# Altium schematic sheet STM32F407VG_B.SchDoc
size A4; SheetNumber: 4; SheetTotal: 8
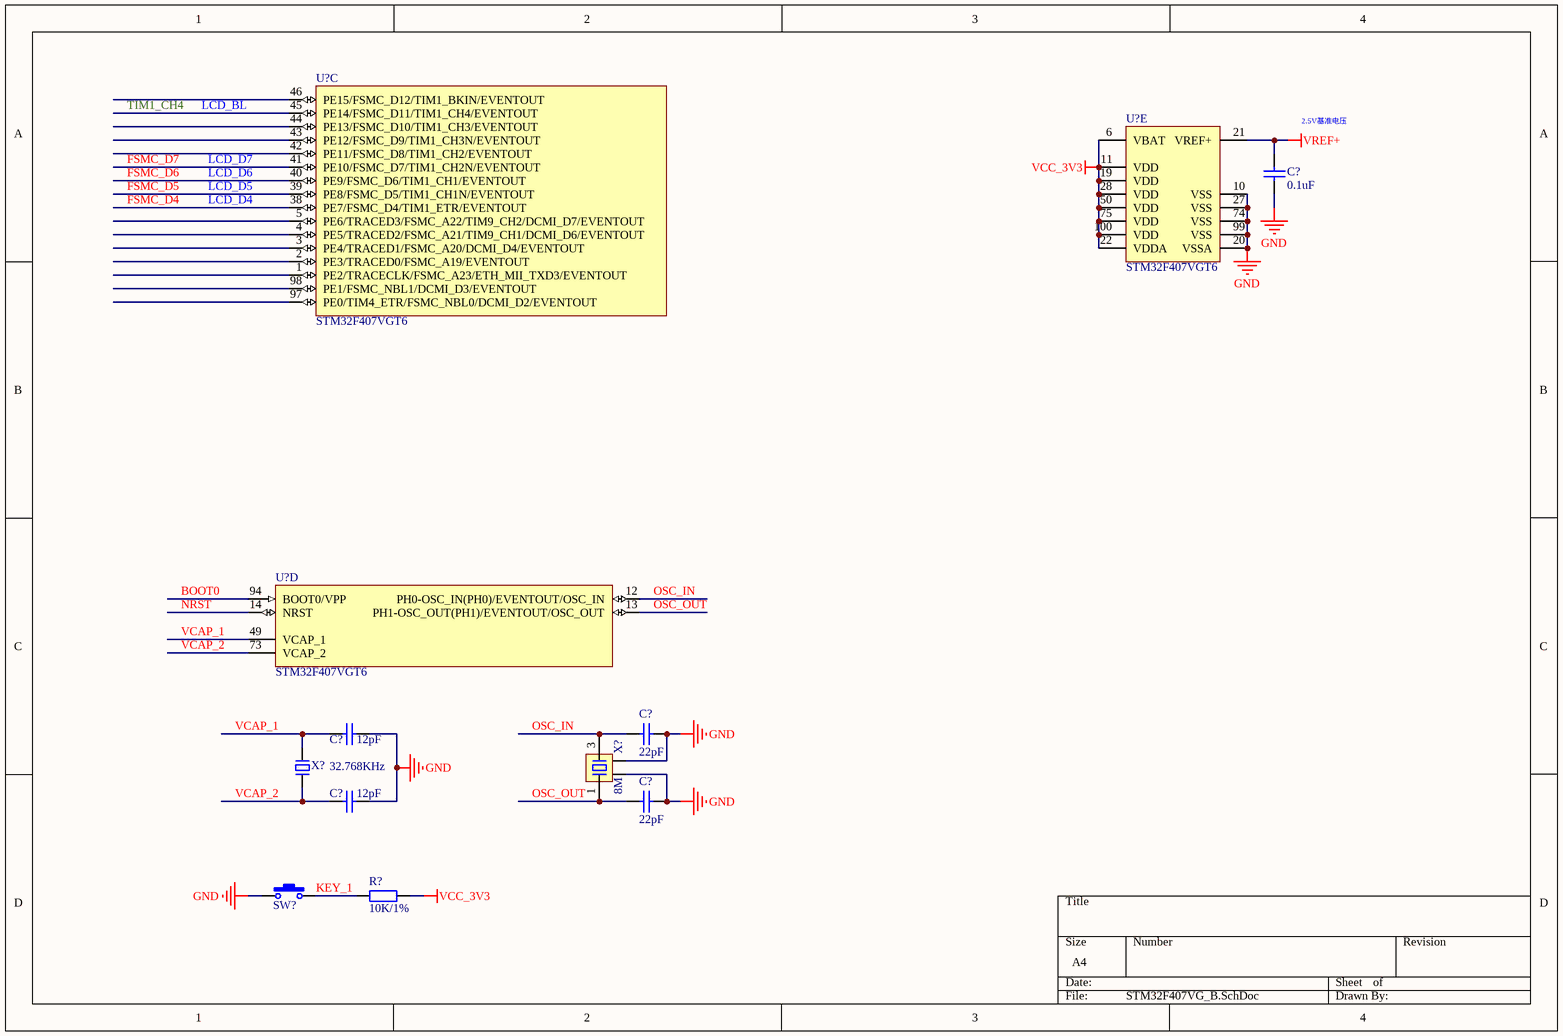
[diagram p0: STM32F407VG_B.SchDoc]

## Parts
(Parts that share a designator on the sheet are numbered #1, #2 ... from top to bottom, then left to right.)
C?#1  0.1uF  [C0402_L]
C?#2  12pF  [C0402_L]
C?#3  22pF  [C0402_L]
C?#4  12pF  [C0402_L]
C?#5  22pF  [C0402_L]
R?  10K/1%  [R0402_L]
SW?  小龟按键  [3*4两脚小龟按键]  (value not drawn)
U?#1  STM32F407VGT6  [LQFP100_L]  (part E of 5)
U?#2  STM32F407VGT6  [LQFP100_L]  (part C of 5)
U?#3  STM32F407VGT6  [LQFP100_L]  (part D of 5)
X?#1  32.768KHz  [XTAL-3215-2P]
X?#2  8M  [XTAL-3225-4P]

## Nets
GND: C?#1.1 C?#2.1 C?#3.2 C?#4.1 C?#5.2 SW?.1 U?#1.10(VSS) U?#1.20(VSSA) U?#1.27(VSS) U?#1.74(VSS) U?#1.99(VSS) X?#2.2 X?#2.4
VCC_3V3: R?.2 U?#1.6(VBAT) U?#1.11(VDD) U?#1.19(VDD) U?#1.22(VDDA) U?#1.28(VDD) U?#1.50(VDD) U?#1.75(VDD) U?#1.100(VDD)
VREF+: C?#1.2 U?#1.21(VREF+)
BOOT0: U?#3.94(BOOT0/VPP)
FSMC_D4: U?#2.38(PE7/FSMC_D4/TIM1_ETR/EVENTOUT)  [also labelled LCD_D4]
FSMC_D5: U?#2.39(PE8/FSMC_D5/TIM1_CH1N/EVENTOUT)  [also labelled LCD_D5]
FSMC_D6: U?#2.40(PE9/FSMC_D6/TIM1_CH1/EVENTOUT)  [also labelled LCD_D6]
FSMC_D7: U?#2.41(PE10/FSMC_D7/TIM1_CH2N/EVENTOUT)  [also labelled LCD_D7]
KEY_1: R?.1 SW?.2
LCD_BL: U?#2.45(PE14/FSMC_D11/TIM1_CH4/EVENTOUT)  [also labelled TIM1_CH4]
NRST: U?#3.14(NRST)
OSC_IN: C?#3.1 U?#3.12(PH0-OSC_IN(PH0)/EVENTOUT/OSC_IN) X?#2.3
OSC_OUT: C?#5.1 U?#3.13(PH1-OSC_OUT(PH1)/EVENTOUT/OSC_OUT) X?#2.1
VCAP_1: C?#2.2 U?#3.49(VCAP_1) X?#1.2
VCAP_2: C?#4.2 U?#3.73(VCAP_2) X?#1.1

Not connected (* = marked no-connect by the designer): U?#2 1(PE2/TRACECLK/FSMC_A23/ETH_MII_TXD3/EVENTOUT) 2(PE3/TRACED0/FSMC_A19/EVENTOUT) 3(PE4/TRACED1/FSMC_A20/DCMI_D4/EVENTOUT) 4(PE5/TRACED2/FSMC_A21/TIM9_CH1/DCMI_D6/EVENTOUT) 5(PE6/TRACED3/FSMC_A22/TIM9_CH2/DCMI_D7/EVENTOUT) 42(PE11/FSMC_D8/TIM1_CH2/EVENTOUT) 43(PE12/FSMC_D9/TIM1_CH3N/EVENTOUT) 44(PE13/FSMC_D10/TIM1_CH3/EVENTOUT) 46(PE15/FSMC_D12/TIM1_BKIN/EVENTOUT) 97(PE0/TIM4_ETR/FSMC_NBL0/DCMI_D2/EVENTOUT) 98(PE1/FSMC_NBL1/DCMI_D3/EVENTOUT)

## Notes on the sheet
- (near C?#1) 2.5V基准电压

## Library data of the parts
C?#1-C?#5 = C: 贴片电容; BOM名称: 无极性贴片电容; 联系卖家，免费查找封装: 唯一出售店铺网址https://shop463601444.taobao.com
R? = R: 贴片电阻; 联系卖家，免费查找封装: 唯一出售店铺网址https://shop463601444.taobao.com; BOM名称: 贴片电阻
SW? = SW-PB: 微动开关; BOM名称: 3x6轻触开关; 联系卖家，免费查找封装: 唯一出售店铺网址https://shop463601444.taobao.com; 封装库来自淘宝卖家ID：黄晶宝石: 其他店铺购入均为盗版假冒封装库，请立即申请退款
U?#1-U?#3 = STM32F407VGT6: ARM Cortex-M4 32b MCU+FPU, 210DMIP, 1024 kB Flash, 192+4 kB RAM, Camera, 82 I/Os, 100-pin LQFP, -40 to +85癈, Tray; Internal RAM: 192kB; Operating Frequency (Processor Speed): 168MHz; A/D Converter: 16x12-bit; D/A Converter: 2x12-bit; 16-bit Timers (IC/OC/PWM): 12x16-bit(24/24/30); 32-bit Timer (IC/OC/PWM): 2x32-bit (8/8/8); Other Timer Functions: 2xWDG, RTC, 24-bit down counter; Serial Interface: 3xSPI/2xI2S/2xI2C/3xUSART(IrDa, ISO7816)/3xUART/2xUSB OTG FS/HS, 2xCAN/Ethernet MAC10/100, SDIO; 联系卖家，免费查找封装: 唯一出售店铺网址https://shop463601444.taobao.com; DatasheetVersion: rev2, Jan-2012; PackageVersion: 2012; PackageReference: LQFP100; PackageDescription: 100-Pin Low Profile Quad Flat Package, 14x14 mm Body, 0.5 mm Pitch; ComponentLink1Description: Manufacturer URL; ComponentLink1URL: http://www.st.com/; ComponentLink2Description: STM32F405/7 Datasheet; ComponentLink2URL: http://www.st.com/internet/com/TECHNICAL_RESOURCES/TECHNICAL_LITERATURE/DATASHEET/DM00037051.pdf; ComponentLink3Description: STM32F4 Web Page; ComponentLink3URL: http://www.st.com/internet/mcu/subclass/1521.jsp
X?#1 = XTAL-2P: 2脚无源晶振(谐振器）; 联系卖家，免费查找封装: 唯一出售店铺网址https://shop463601444.taobao.com; BOM名称: 2脚无源晶振(谐振器）
X?#2 = XTAL-4P: 4脚无源晶振(谐振器）; 联系卖家，免费查找封装: 唯一出售店铺网址https://shop463601444.taobao.com; BOM名称: 4脚无源晶振(谐振器）